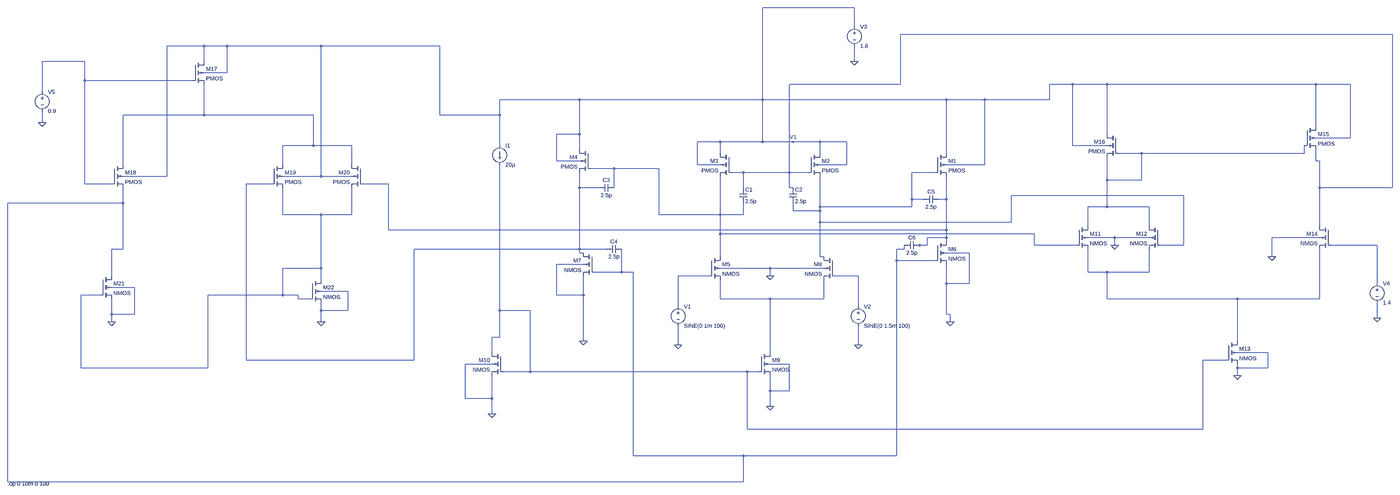
[diagram p0: schematic cmfb_double.asc, whole sheet]
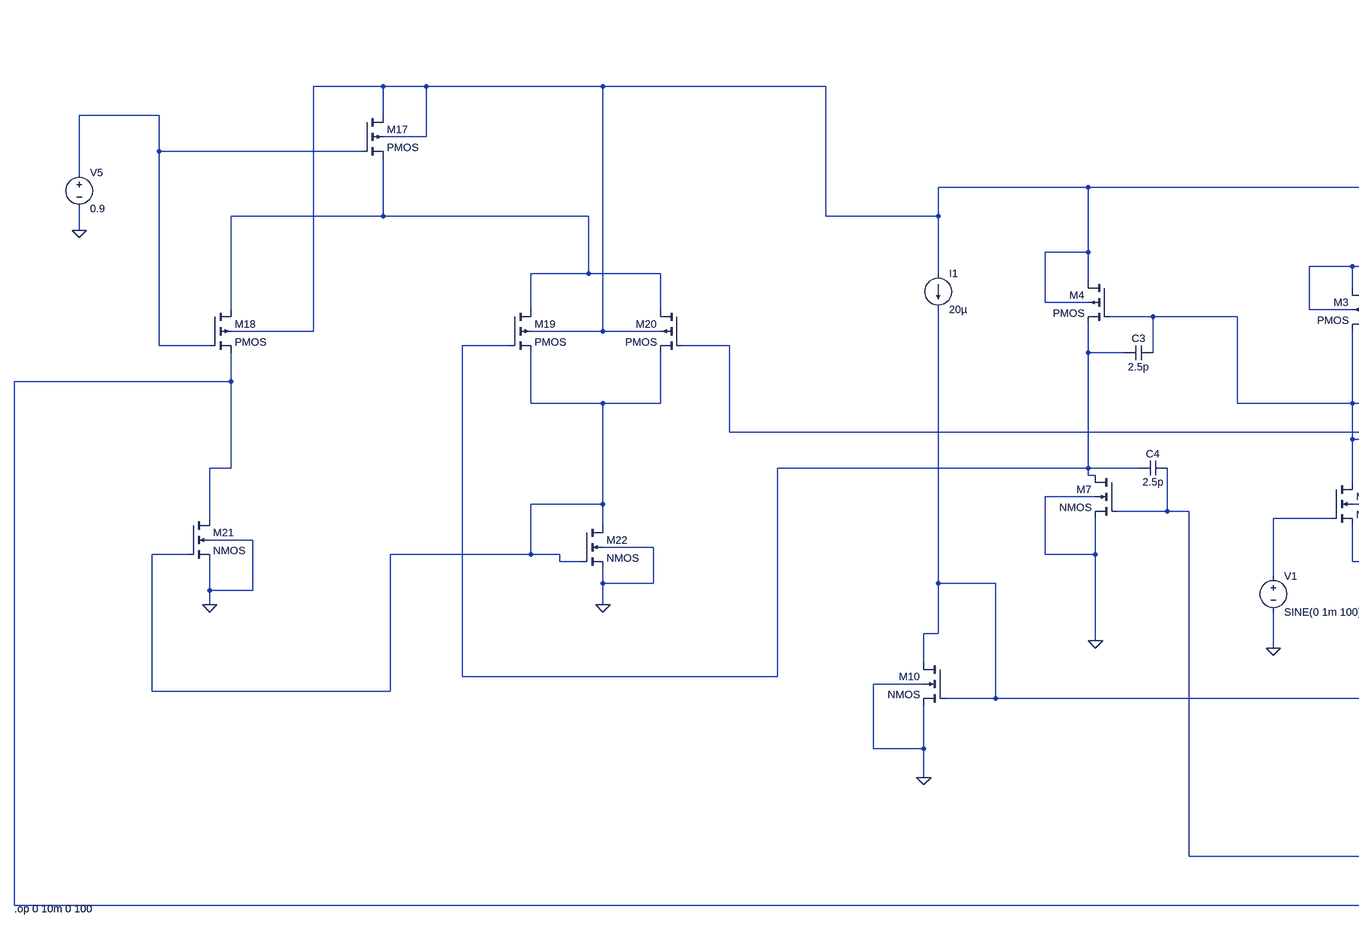
[diagram p1: schematic cmfb_double.asc, part, row 1 of 1, column 1 of 2]
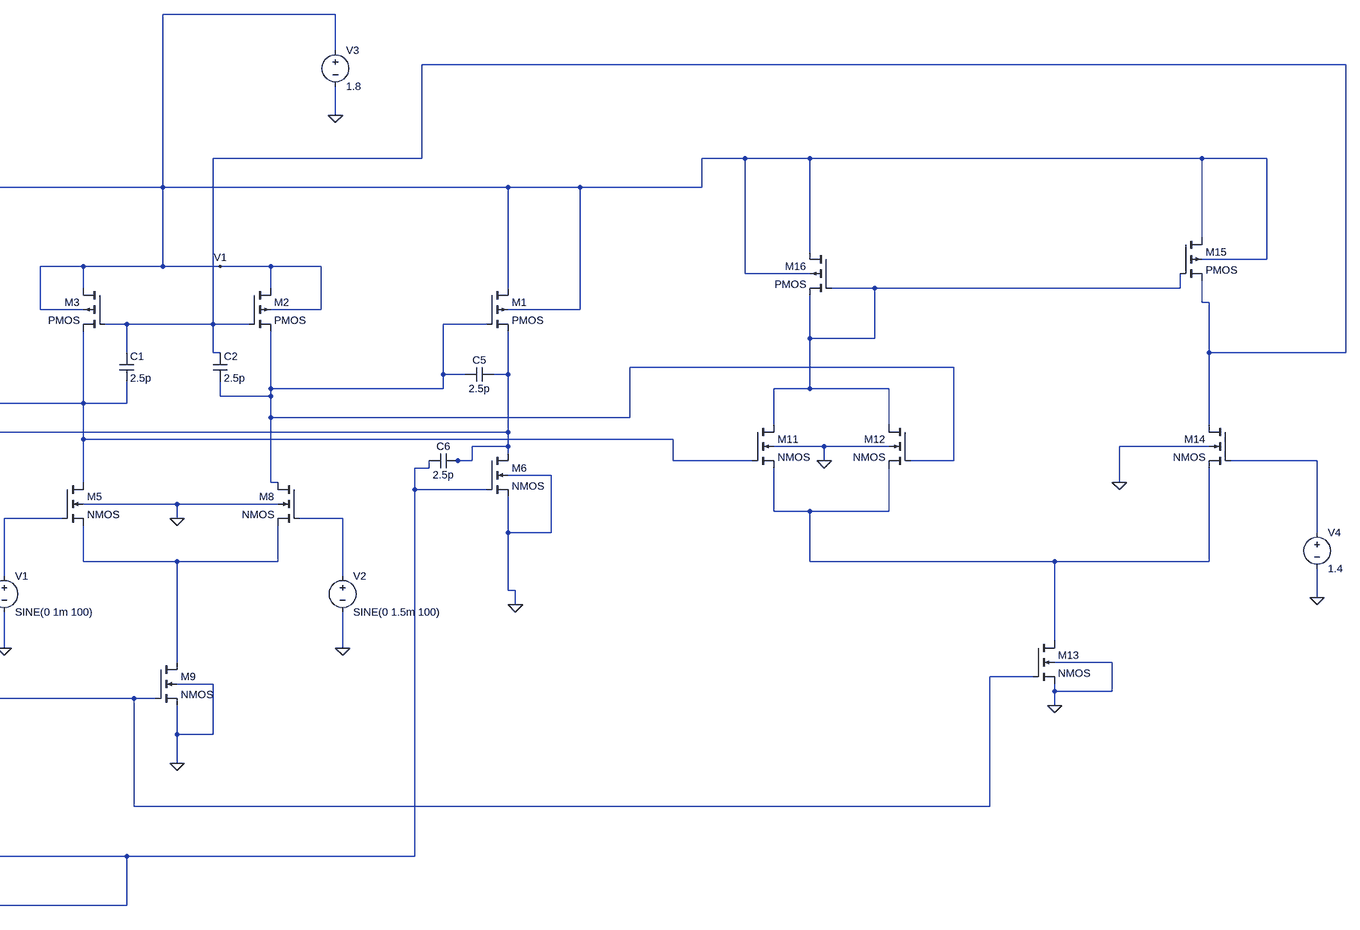
[diagram p2: schematic cmfb_double.asc, part, row 1 of 1, column 2 of 2]
cmfb_double.asc, the LTspice schematic file:
Version 4
SHEET 1 2852 2008
WIRE 160 -624 -224 -624
WIRE 160 -544 160 -624
WIRE 2848 -512 352 -512
WIRE -4272 -464 -4432 -464
WIRE -4176 -464 -4272 -464
WIRE -3760 -464 -4176 -464
WIRE -3616 -464 -3760 -464
WIRE -2256 -464 -3616 -464
WIRE -4960 -400 -5248 -400
WIRE -4272 -400 -4272 -464
WIRE 160 -400 160 -464
WIRE -4176 -352 -4176 -464
WIRE -4176 -352 -4272 -352
WIRE -4960 -320 -4960 -400
WIRE -4320 -320 -4960 -320
WIRE 352 -304 352 -512
WIRE 352 -304 -112 -304
WIRE 1504 -304 1408 -304
WIRE 1648 -304 1504 -304
WIRE 2528 -304 1648 -304
WIRE 2672 -304 2528 -304
WIRE -5248 -272 -5248 -400
WIRE -1056 -240 -1888 -240
WIRE -224 -240 -224 -624
WIRE -224 -240 -1056 -240
WIRE 544 -240 -224 -240
WIRE 704 -240 544 -240
WIRE 1408 -240 1408 -304
WIRE 1408 -240 704 -240
WIRE -4560 -176 -4800 -176
WIRE -4272 -176 -4272 -304
WIRE -4272 -176 -4560 -176
WIRE -3920 -176 -4272 -176
WIRE -3792 -176 -3920 -176
WIRE -2256 -176 -2256 -464
WIRE -1888 -176 -1888 -240
WIRE -1888 -176 -2256 -176
WIRE -5248 -144 -5248 -192
WIRE 2528 -128 2528 -304
WIRE -1056 -96 -1056 -240
WIRE -1056 -96 -1152 -96
WIRE 1648 -96 1648 -304
WIRE 2672 -80 2672 -304
WIRE 2672 -80 2528 -80
WIRE -400 -64 -496 -64
WIRE -224 -64 -224 -240
WIRE -224 -64 -400 -64
WIRE -96 -64 -224 -64
WIRE 16 -64 -96 -64
WIRE 128 -64 16 -64
WIRE -3792 -48 -3792 -176
WIRE -3792 -48 -3920 -48
WIRE -3632 -48 -3792 -48
WIRE -1888 -48 -1888 -176
WIRE 1504 -48 1504 -304
WIRE 1648 -48 1504 -48
WIRE -1056 -32 -1056 -96
WIRE -400 -16 -400 -64
WIRE 16 -16 16 -64
WIRE 544 -16 544 -240
WIRE 1792 -16 1696 -16
WIRE 2480 -16 2480 -48
WIRE 2480 -16 1792 -16
WIRE -1152 16 -1152 -96
WIRE -1056 16 -1152 16
WIRE 2528 16 2528 -32
WIRE 2544 16 2528 16
WIRE -4800 32 -4800 -176
WIRE -3920 32 -3920 -48
WIRE -3632 32 -3632 -48
WIRE -496 32 -496 -64
WIRE -400 32 -496 32
WIRE 128 32 128 -64
WIRE 128 32 16 32
WIRE 704 32 704 -240
WIRE 704 32 544 32
WIRE -912 48 -1008 48
WIRE -656 48 -912 48
WIRE -304 64 -352 64
WIRE -112 64 -112 -304
WIRE -112 64 -304 64
WIRE -32 64 -112 64
WIRE 416 64 400 64
WIRE 496 64 416 64
WIRE -4432 80 -4432 -464
WIRE -4432 80 -4800 80
WIRE -3760 80 -3760 -464
WIRE -3760 80 -3920 80
WIRE -3632 80 -3760 80
WIRE 1648 96 1648 0
WIRE 1792 96 1792 -16
WIRE 1792 96 1648 96
WIRE -4960 112 -4960 -320
WIRE -4848 112 -4960 112
WIRE -3968 112 -4096 112
WIRE -2880 112 -3584 112
WIRE -1056 128 -1056 64
WIRE -976 128 -1056 128
WIRE -912 128 -912 48
WIRE -304 128 -304 64
WIRE -112 128 -112 64
WIRE -96 128 -112 128
WIRE 2544 128 2544 16
WIRE 2848 128 2848 -512
WIRE 2848 128 2544 128
WIRE 1968 160 1248 160
WIRE 400 176 400 64
WIRE 448 176 400 176
WIRE 544 176 544 80
WIRE 544 176 512 176
WIRE -4800 192 -4800 128
WIRE -4800 192 -5392 192
WIRE 16 208 16 80
WIRE 400 208 400 176
WIRE 400 208 16 208
WIRE 1648 208 1648 96
WIRE 1648 208 1568 208
WIRE 1824 208 1648 208
WIRE -96 224 -96 192
WIRE 16 224 16 208
WIRE 16 224 -96 224
WIRE -3920 240 -3920 128
WIRE -3760 240 -3920 240
WIRE -3632 240 -3632 128
WIRE -3632 240 -3760 240
WIRE -656 240 -656 48
WIRE -400 240 -400 80
WIRE -400 240 -656 240
WIRE -304 240 -304 192
WIRE -304 240 -400 240
WIRE -1056 272 -1056 128
WIRE 16 272 16 224
WIRE 1248 272 1248 160
WIRE 1248 272 16 272
WIRE 1568 288 1568 208
WIRE 1824 288 1824 208
WIRE 2544 288 2544 128
WIRE -2880 304 -2880 112
WIRE 544 304 544 176
WIRE 544 304 -2880 304
WIRE -400 320 -400 240
WIRE 1344 320 -400 320
WIRE 544 336 544 304
WIRE 544 336 464 336
WIRE 1680 336 1568 336
WIRE 1824 336 1680 336
WIRE 2544 336 2336 336
WIRE 544 352 544 336
WIRE 432 368 416 368
WIRE 464 368 464 336
WIRE 464 368 432 368
WIRE 1344 368 1344 320
WIRE 1424 368 1344 368
WIRE 1520 368 1424 368
WIRE 1680 368 1680 336
WIRE 1968 368 1968 160
WIRE 1968 368 1872 368
WIRE 2784 368 2592 368
WIRE -4800 384 -4800 192
WIRE -4800 384 -4848 384
WIRE -1056 384 -1056 272
WIRE -1056 384 -2400 384
WIRE -944 384 -1056 384
WIRE 368 384 368 368
WIRE 368 384 336 384
WIRE -1056 400 -1056 384
WIRE -1040 400 -1056 400
WIRE 640 400 544 400
WIRE -400 416 -400 320
WIRE 16 416 16 272
WIRE 32 416 16 416
WIRE 2336 416 2336 336
WIRE 336 432 336 384
WIRE 384 432 336 432
WIRE 496 432 384 432
WIRE -1040 448 -1152 448
WIRE -3760 464 -3760 240
WIRE -3760 464 -3920 464
WIRE -192 464 -400 464
WIRE 32 464 -192 464
WIRE -960 480 -992 480
WIRE -880 480 -880 384
WIRE -880 480 -960 480
WIRE -832 480 -880 480
WIRE 1568 480 1568 384
WIRE 1648 480 1568 480
WIRE 1824 480 1824 384
WIRE 1824 480 1648 480
WIRE -4848 496 -4848 384
WIRE -448 496 -576 496
WIRE -192 496 -192 464
WIRE 176 496 80 496
WIRE -3760 512 -3760 464
WIRE 544 528 544 448
WIRE 640 528 640 400
WIRE 640 528 544 528
WIRE 2784 528 2784 368
WIRE -4752 544 -4848 544
WIRE -3648 560 -3760 560
WIRE -4896 576 -4976 576
WIRE -3920 576 -3920 464
WIRE -3920 576 -4256 576
WIRE -3856 576 -3920 576
WIRE -1152 576 -1152 448
WIRE -1040 576 -1040 496
WIRE -1040 576 -1152 576
WIRE -3856 592 -3856 576
WIRE -3808 592 -3856 592
WIRE -400 592 -400 512
WIRE -256 592 -400 592
WIRE -192 592 -256 592
WIRE -64 592 -192 592
WIRE 32 592 32 512
WIRE 32 592 -64 592
WIRE 1648 592 1648 480
WIRE 2192 592 1648 592
WIRE 2544 592 2544 384
WIRE 2544 592 2192 592
WIRE -576 624 -576 496
WIRE 176 624 176 496
WIRE -3760 640 -3760 608
WIRE -3648 640 -3648 560
WIRE -3648 640 -3760 640
WIRE -1888 640 -1888 32
WIRE -1760 640 -1888 640
WIRE -4848 656 -4848 592
WIRE -4752 656 -4752 544
WIRE -4752 656 -4848 656
WIRE 544 656 544 528
WIRE 560 656 544 656
WIRE 2784 672 2784 608
WIRE -4848 688 -4848 656
WIRE -3760 688 -3760 640
WIRE 560 688 560 656
WIRE -192 704 -192 592
WIRE -1888 752 -1888 640
WIRE -1888 752 -1920 752
WIRE -1040 768 -1040 576
WIRE 2192 768 2192 592
WIRE -576 784 -576 704
WIRE 176 784 176 704
WIRE -1920 816 -1920 752
WIRE -192 816 -192 704
WIRE 2320 816 2192 816
WIRE -4096 848 -4096 112
WIRE -2400 848 -2400 384
WIRE -2400 848 -4096 848
WIRE 2144 848 2048 848
WIRE -1920 864 -2032 864
WIRE -112 864 -192 864
WIRE -4976 880 -4976 576
WIRE -4528 880 -4976 880
WIRE -4256 880 -4256 576
WIRE -4256 880 -4528 880
WIRE 2192 880 2192 864
WIRE 2320 880 2320 816
WIRE 2320 880 2192 880
WIRE -1760 896 -1760 640
WIRE -1760 896 -1872 896
WIRE -288 896 -1760 896
WIRE -240 896 -288 896
WIRE 2192 912 2192 880
WIRE -192 976 -192 912
WIRE -112 976 -112 864
WIRE -112 976 -192 976
WIRE -2032 1008 -2032 864
WIRE -1920 1008 -1920 912
WIRE -1920 1008 -2032 1008
WIRE -192 1040 -192 976
WIRE -1920 1072 -1920 1008
WIRE -288 1136 -288 896
WIRE 144 1136 -288 1136
WIRE 2048 1136 2048 848
WIRE 2048 1136 144 1136
WIRE -832 1312 -832 480
WIRE -304 1312 -832 1312
WIRE 336 1312 336 432
WIRE 336 1312 -304 1312
WIRE -5392 1984 -5392 192
WIRE -304 1984 -304 1312
WIRE -304 1984 -5392 1984
FLAG -192 1040 0
FLAG -192 496 0
FLAG -576 784 0
FLAG 176 784 0
FLAG -1040 768 0
FLAG 560 688 0
FLAG 160 -400 0
FLAG -1920 1072 0
FLAG 2192 912 0
FLAG 1680 368 0
FLAG 2336 416 0
FLAG 2784 672 0
FLAG -4848 688 0
FLAG -3760 688 0
FLAG -5248 -144 0
FLAG -96 -64 V1
DATAFLAG 16 208 ""
DATAFLAG -112 64 ""
DATAFLAG -304 64 ""
DATAFLAG -224 -64 ""
DATAFLAG -400 240 ""
DATAFLAG -1056 272 ""
DATAFLAG 16 272 ""
DATAFLAG 1424 368 ""
DATAFLAG 2544 128 ""
DATAFLAG 1648 96 ""
DATAFLAG 2192 592 ""
DATAFLAG 144 1136 ""
DATAFLAG -1760 896 ""
DATAFLAG -4560 -176 ""
DATAFLAG -3616 -464 ""
DATAFLAG -3920 -176 ""
DATAFLAG -4528 880 ""
DATAFLAG -256 592 ""
DATAFLAG -64 592 ""
DATAFLAG -192 704 ""
DATAFLAG 384 432 ""
DATAFLAG 416 64 ""
DATAFLAG -912 48 ""
DATAFLAG -960 480 ""
SYMBOL pmos4 496 -16 R0
SYMATTR InstName M1
SYMATTR Value2 l=5u w=10u
SYMBOL pmos4 -32 -16 R0
SYMATTR InstName M2
SYMATTR Value2 l=5u w=10u
SYMBOL pmos4 -352 -16 M0
SYMATTR InstName M3
SYMATTR Value2 l=5u w=10u
SYMBOL pmos4 -1008 -32 M0
SYMATTR InstName M4
SYMATTR Value2 l=5u w=10u
SYMBOL nmos4 -448 416 R0
SYMATTR InstName M5
SYMATTR Value2 l=1u w=20u
SYMBOL nmos4 496 352 R0
SYMATTR InstName M6
SYMATTR Value2 l=1u w=20u
SYMBOL nmos4 -992 400 M0
SYMATTR InstName M7
SYMATTR Value2 l=1u w=20u
SYMBOL nmos4 80 416 M0
SYMATTR InstName M8
SYMATTR Value2 l=1u w=20u
SYMBOL nmos4 -240 816 R0
SYMATTR InstName M9
SYMATTR Value2 l=2u w=20u
SYMBOL voltage -576 608 R0
WINDOW 123 0 0 Left 2
WINDOW 39 0 0 Left 2
SYMATTR InstName V1
SYMATTR Value SINE(0 1m 100)
SYMBOL voltage 176 608 R0
WINDOW 123 0 0 Left 2
WINDOW 39 0 0 Left 2
SYMATTR InstName V2
SYMATTR Value SINE(0 1.5m 100)
SYMBOL voltage 160 -560 R0
WINDOW 123 0 0 Left 2
WINDOW 39 0 0 Left 2
SYMATTR InstName V3
SYMATTR Value 1.8
SYMBOL current -1888 -48 R0
WINDOW 123 0 0 Left 2
WINDOW 39 0 0 Left 2
SYMATTR InstName I1
SYMATTR Value 20µ
SYMBOL nmos4 -1872 816 M0
SYMATTR InstName M10
SYMATTR Value2 l=2u w=20u
SYMBOL nmos4 1520 288 R0
SYMATTR InstName M11
SYMATTR Value2 l=1u w=20u
SYMBOL nmos4 1872 288 M0
SYMATTR InstName M12
SYMATTR Value2 l=1u w=20u
SYMBOL nmos4 2592 288 M0
SYMATTR InstName M14
SYMATTR Value2 l=1u w=20u
SYMBOL pmos4 2480 -128 R0
SYMATTR InstName M15
SYMATTR Value2 l=5u w=10u
SYMBOL pmos4 1696 -96 M0
SYMATTR InstName M16
SYMATTR Value2 l=5u w=10u
SYMBOL nmos4 2144 768 R0
SYMATTR InstName M13
SYMATTR Value2 l=2u w=20u
SYMBOL voltage 2784 512 R0
WINDOW 123 0 0 Left 2
WINDOW 39 0 0 Left 2
SYMATTR InstName V4
SYMATTR Value 1.4
SYMBOL pmos4 -4320 -400 R0
SYMATTR InstName M17
SYMATTR Value2 l=2u w=20u
SYMBOL pmos4 -4848 32 R0
SYMATTR InstName M18
SYMATTR Value2 l=1u w=20u
SYMBOL pmos4 -3968 32 R0
SYMATTR InstName M19
SYMATTR Value2 l=1u w=20u
SYMBOL pmos4 -3584 32 M0
SYMATTR InstName M20
SYMATTR Value2 l=1u w=20u
SYMBOL nmos4 -4896 496 R0
SYMATTR InstName M21
SYMATTR Value2 l=5u w=20u
SYMBOL nmos4 -3808 512 R0
SYMATTR InstName M22
SYMATTR Value2 l=5u w=20u
SYMBOL voltage -5248 -288 R0
WINDOW 123 0 0 Left 2
WINDOW 39 0 0 Left 2
SYMATTR InstName V5
SYMATTR Value 0.9
SYMBOL cap -320 128 R0
SYMATTR InstName C1
SYMATTR Value 2.5p
SYMBOL cap -112 128 R0
SYMATTR InstName C2
SYMATTR Value 2.5p
SYMBOL cap -976 112 M90
WINDOW 0 0 32 VBottom 2
WINDOW 3 32 32 VTop 2
SYMATTR InstName C3
SYMATTR Value 2.5p
SYMBOL cap -944 368 M90
WINDOW 0 0 32 VBottom 2
WINDOW 3 32 32 VTop 2
SYMATTR InstName C4
SYMATTR Value 2.5p
SYMBOL cap 448 160 M90
WINDOW 0 0 32 VBottom 2
WINDOW 3 32 32 VTop 2
SYMATTR InstName C5
SYMATTR Value 2.5p
SYMBOL cap 368 352 M90
WINDOW 0 0 32 VBottom 2
WINDOW 3 32 32 VTop 2
SYMATTR InstName C6
SYMATTR Value 2.5p
TEXT -5392 1992 Left 2 !.op 0 10m 0 100

The netlist it stands for:
* cmfb_double.asc
M1 V1 N006 N008 V1 PMOS l=5u w=10u
M2 V1 N001 N006 V1 PMOS l=5u w=10u
M3 V1 N001 N005 V1 PMOS l=5u w=10u
M4 V1 N005 N007 V1 PMOS l=5u w=10u
M5 N005 N013 N015 0 NMOS l=1u w=20u
M6 N008 N009 0 0 NMOS l=1u w=20u
M7 N007 N009 0 0 NMOS l=1u w=20u
M8 N006 N014 N015 0 NMOS l=1u w=20u
M9 N015 N016 0 0 NMOS l=2u w=20u
V1 N013 0 SINE(0 1m 100)
V2 N014 0 SINE(0 1.5m 100)
V3 V1 0 1.8
I1 V1 N016 20µ
M10 N016 N016 0 0 NMOS l=2u w=20u
M11 N004 N005 N012 0 NMOS l=1u w=20u
M12 N004 N006 N012 0 NMOS l=1u w=20u
M14 N001 N011 N012 0 NMOS l=1u w=20u
M15 V1 N004 N001 V1 PMOS l=5u w=10u
M16 V1 N004 N004 V1 PMOS l=5u w=10u
M13 N012 N016 0 0 NMOS l=2u w=20u
V4 N011 0 1.4
M17 V1 N002 N003 V1 PMOS l=2u w=20u
M18 N003 N002 N009 V1 PMOS l=1u w=20u
M19 N003 N007 N010 V1 PMOS l=1u w=20u
M20 N003 N008 N010 V1 PMOS l=1u w=20u
M21 N009 N010 0 0 NMOS l=5u w=20u
M22 N010 N010 0 0 NMOS l=5u w=20u
V5 N002 0 0.9
C1 N001 N005 2.5p
C2 N001 N006 2.5p
C3 N007 N005 2.5p
C4 N007 N009 2.5p
C5 N006 N008 2.5p
C6 N009 N008 2.5p
.model NMOS NMOS
.model PMOS PMOS
.lib standard.mos
.op 0 10m 0 100
.backanno
.end